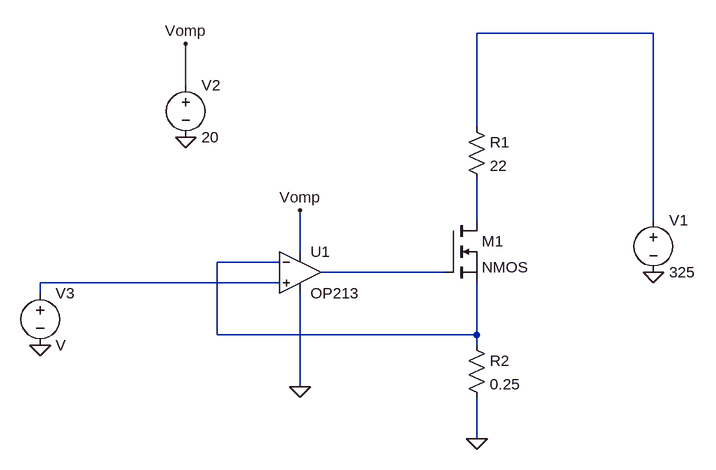
[diagram p0: schematic impulse_analyze.asc]
impulse_analyze.asc, the LTspice schematic file:
Version 4
SHEET 1 880 680
WIRE 496 -176 224 -176
WIRE -224 -96 -224 -160
WIRE 224 -32 224 -176
WIRE 224 112 224 48
WIRE 496 112 496 -176
WIRE -48 160 -48 96
WIRE -80 176 -176 176
WIRE 176 192 -16 192
WIRE -80 208 -448 208
WIRE -448 224 -448 208
WIRE -176 288 -176 176
WIRE 224 288 224 208
WIRE 224 288 -176 288
WIRE 224 304 224 288
WIRE -48 368 -48 224
WIRE 224 448 224 384
FLAG 224 448 0
FLAG 496 192 0
FLAG -48 368 0
FLAG -224 -16 0
FLAG -224 -160 Vomp
FLAG -48 96 Vomp
FLAG -448 304 0
SYMBOL nmos 176 112 R0
SYMATTR InstName M1
SYMBOL res 208 -48 R0
SYMATTR InstName R1
SYMATTR Value 22
SYMBOL res 208 288 R0
SYMATTR InstName R2
SYMATTR Value 0.25
SYMBOL OpAmps\\OP213 -48 128 R0
SYMATTR InstName U1
SYMBOL voltage 496 96 R0
WINDOW 123 0 0 Left 0
WINDOW 39 0 0 Left 0
SYMATTR InstName V1
SYMATTR Value 325
SYMBOL voltage -224 -112 R0
WINDOW 123 0 0 Left 0
WINDOW 39 0 0 Left 0
SYMATTR InstName V2
SYMATTR Value 20
SYMBOL voltage -448 208 R0
SYMATTR InstName V3

The netlist it stands for:
* impulse_analyze.asc
M1 N002 N004 N003 N003 NMOS
R1 N001 N002 22
R2 N003 0 0.25
XU1 N005 N003 Vomp 0 N004 OP213  ; pins In+ In- V+ V- OUT
V1 N001 0 325
V2 Vomp 0 20
V3 N005 0 V
.model NMOS NMOS
.model PMOS PMOS
.lib standard.mos
.backanno
.end